# EAGLE board MMU8Ltqfp (EAGLE 6.6.0)
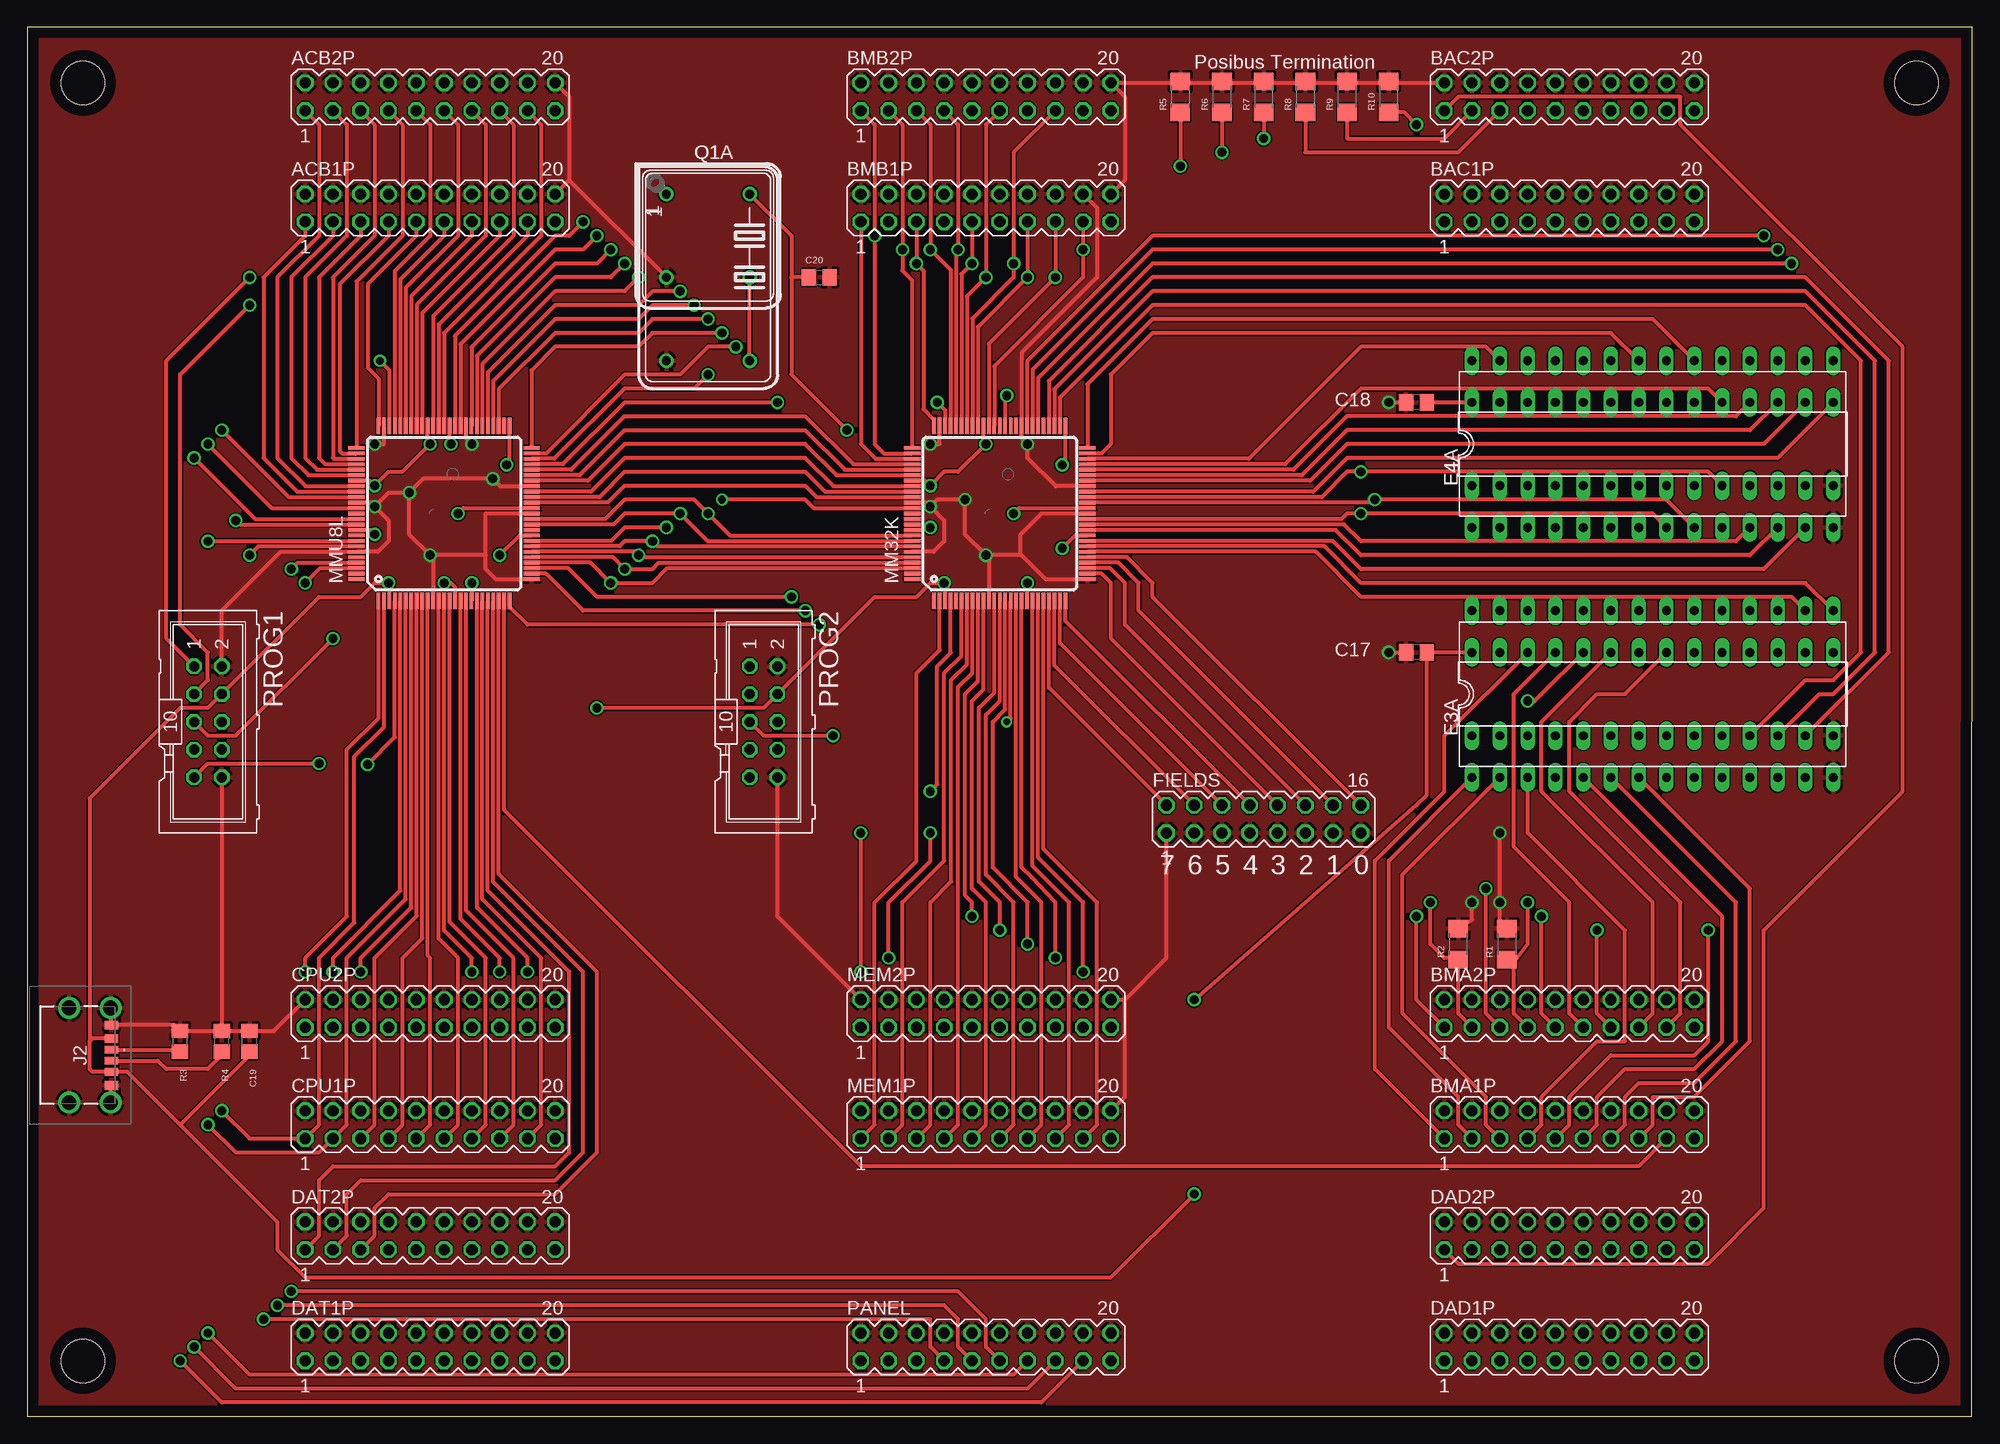
[diagram p2: board, top side]
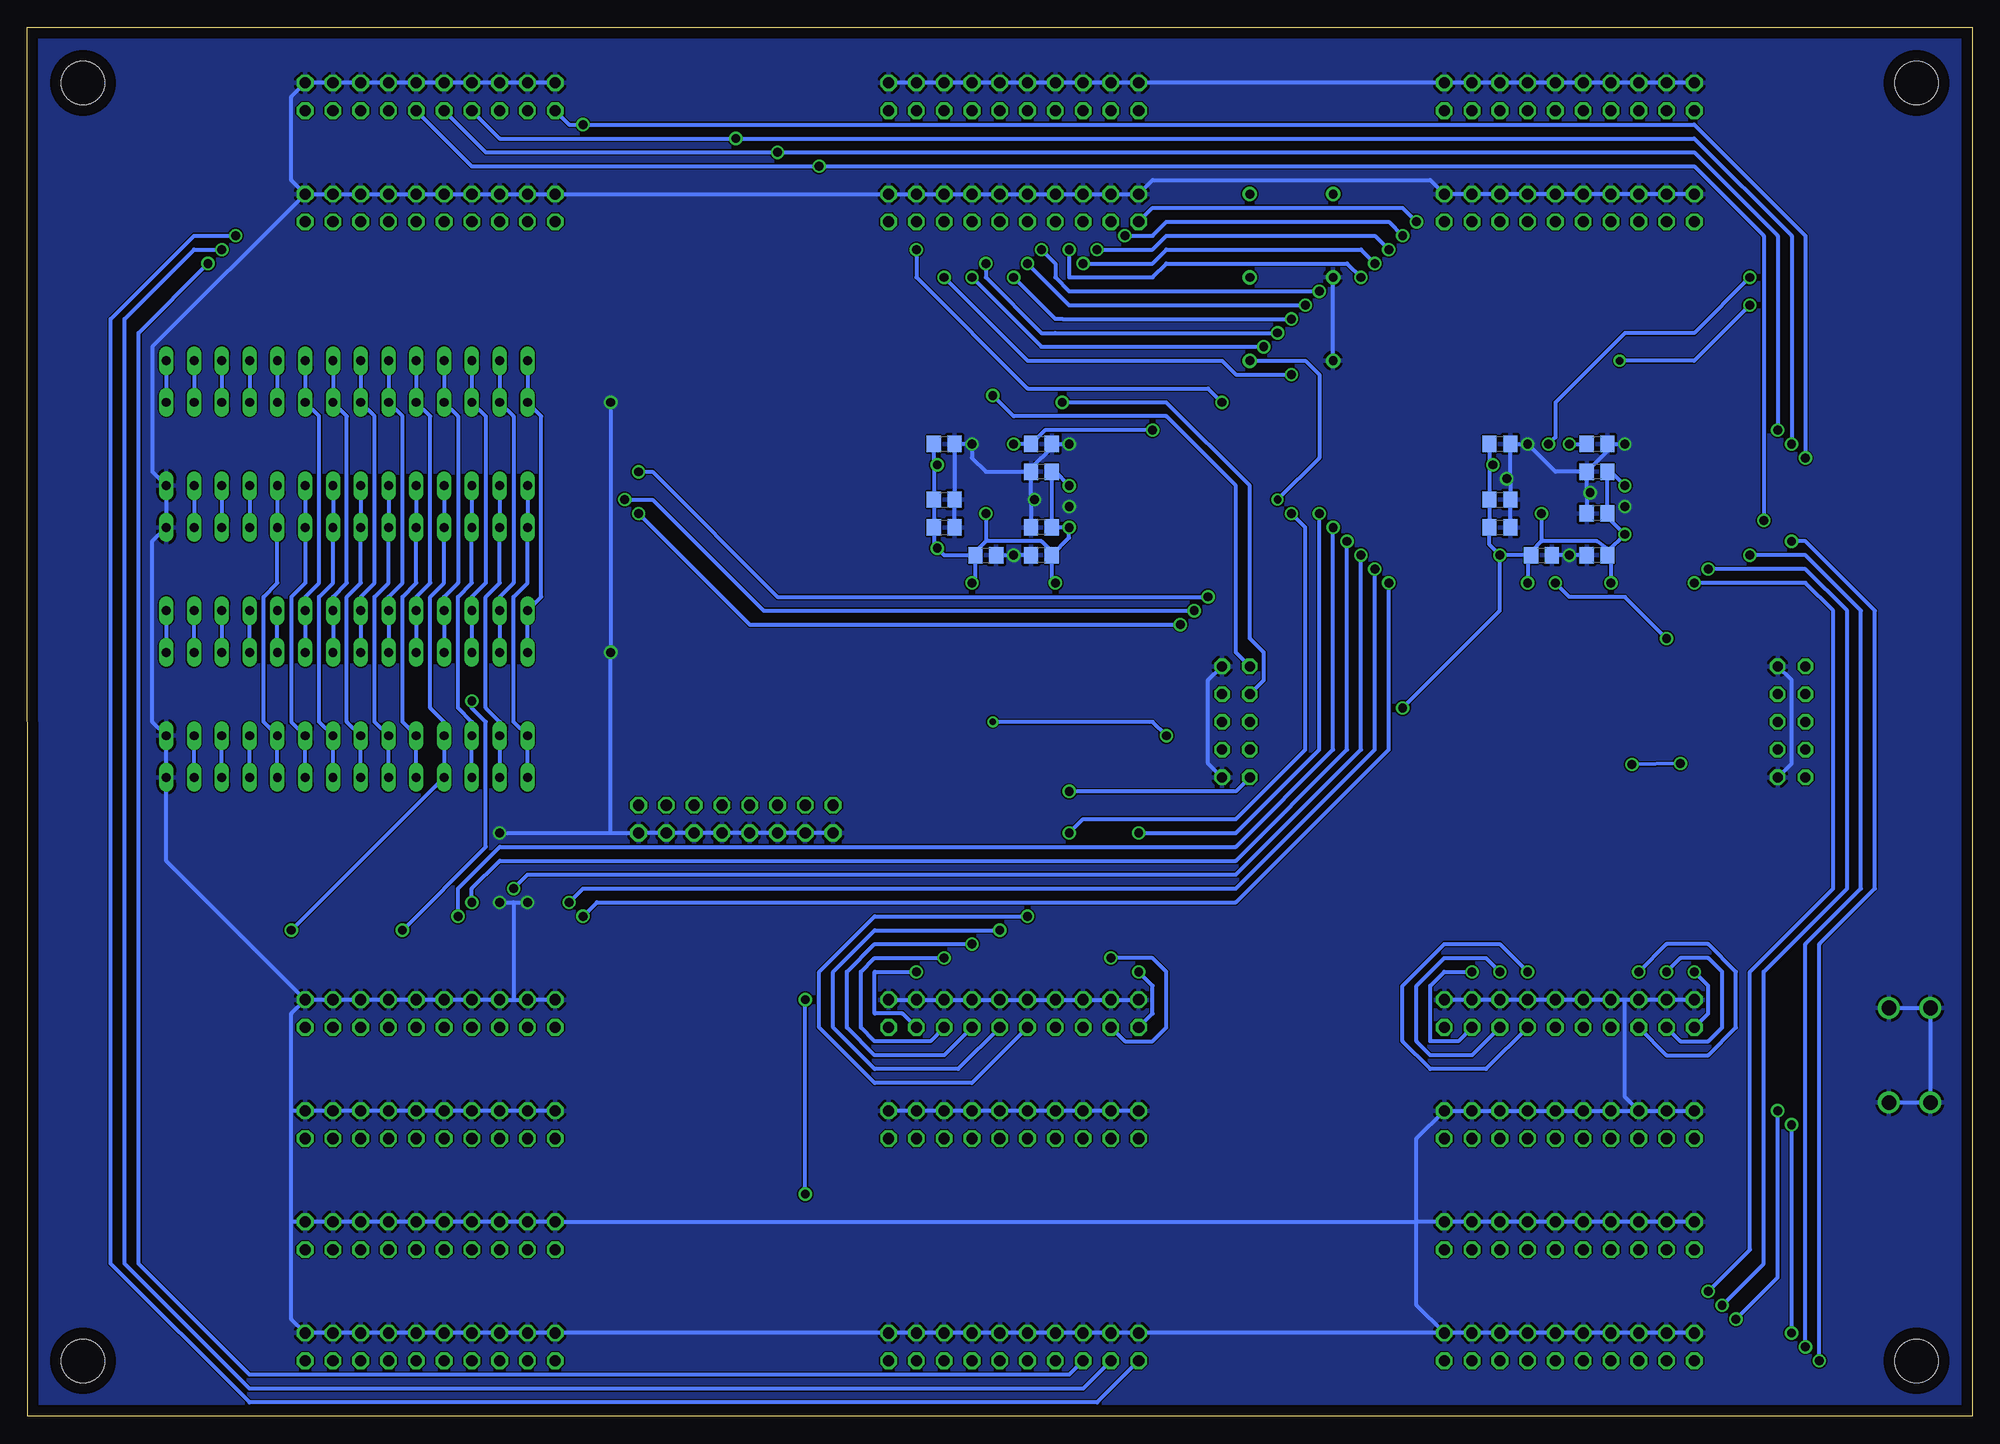
[diagram p3: board, bottom side, seen from below]

Size 177.8 x 127 mm. Coordinates in mm from the lower left corner, seen from the top.
Outline: 0,0 177.78,0 177.8,127 0,127 0,0
Copper layers (1*16): Top 0.035mm / dielectric 1.5mm / Bottom 0.035mm
Design rules "default *": minimum track width 10mil, minimum drill 24mil, track to track 5mil, track to pad 5mil, pad to pad 5mil, via to via 8mil, smd to smd 5mil, copper to edge 40mil, drill to drill 8mil, minimum pad ring 10mil, minimum via ring 8mil, stop-mask expansion 4mil, vias tented up to drill 0mil, thermal gap 10mil
Net classes: 0 default: width 0.356 mm; 1 supply: width 0.356 mm
Holes 3.97 mm at 5.08,121.92 172.72,121.92 172.72,5.08 5.08,5.08

## Footprints (pad centres in the part's own frame; a part is rotated, then mirrored left to right if it is on the bottom)
MA10-2 = drill 1.016 octagon: 1 -11.43,-1.27; 2 -11.43,1.27; 3 -8.89,-1.27; 4 -8.89,1.27; 5 -6.35,-1.27; 6 -6.35,1.27; 7 -3.81,-1.27; 8 -3.81,1.27; 9 -1.27,-1.27; 10 -1.27,1.27; 11 1.27,-1.27; 12 1.27,1.27; 13 3.81,-1.27; 14 3.81,1.27; 15 6.35,-1.27; 16 6.35,1.27; 17 8.89,-1.27; 18 8.89,1.27; 19 11.43,-1.27; 20 11.43,1.27
C0805 = smd 1.3 x 1.5: 1 -0.95,0; 2 0.95,0
DIL28-6 = drill 0.813 long: 1 -16.51,-7.62; 2 -13.97,-7.62; 3 -11.43,-7.62; 4 -8.89,-7.62; 5 -6.35,-7.62; 6 -3.81,-7.62; 7 -1.27,-7.62; 8 1.27,-7.62; 9 3.81,-7.62; 10 6.35,-7.62; 11 8.89,-7.62; 12 11.43,-7.62; 13 13.97,-7.62; 14 16.51,-7.62; 15 16.51,7.62; 16 13.97,7.62; 17 11.43,7.62; 18 8.89,7.62; 19 6.35,7.62; 20 3.81,7.62; 21 1.27,7.62; 22 -1.27,7.62; 23 -3.81,7.62; 24 -6.35,7.62; 25 -8.89,7.62; 26 -11.43,7.62; 27 -13.97,7.62; 28 -16.51,7.62
DIL28-3 = drill 0.813 long: 1 -16.51,-3.81; 2 -13.97,-3.81; 3 -11.43,-3.81; 4 -8.89,-3.81; 5 -6.35,-3.81; 6 -3.81,-3.81; 7 -1.27,-3.81; 8 1.27,-3.81; 9 3.81,-3.81; 10 6.35,-3.81; 11 8.89,-3.81; 12 11.43,-3.81; 13 13.97,-3.81; 14 16.51,-3.81; 15 16.51,3.81; 16 13.97,3.81; 17 11.43,3.81; 18 8.89,3.81; 19 6.35,3.81; 20 3.81,3.81; 21 1.27,3.81; 22 -1.27,3.81; 23 -3.81,3.81; 24 -6.35,3.81; 25 -8.89,3.81; 26 -11.43,3.81; 27 -13.97,3.81; 28 -16.51,3.81
MA08-2 = drill 1.016 octagon: 1 -8.89,-1.27; 2 -8.89,1.27; 3 -6.35,-1.27; 4 -6.35,1.27; 5 -3.81,-1.27; 6 -3.81,1.27; 7 -1.27,-1.27; 8 -1.27,1.27; 9 1.27,-1.27; 10 1.27,1.27; 11 3.81,-1.27; 12 3.81,1.27; 13 6.35,-1.27; 14 6.35,1.27; 15 8.89,-1.27; 16 8.89,1.27
USB497000A = smd 0.7 x 1.2: A5 -0.5,3.88; B5 0.5,3.88 | smd 0.76 x 1.2: A9 1.52,3.88; B9 -1.52,3.88 | smd 0.8 x 1.2: A12 2.75,3.88; B12 -2.75,3.88 | drill 1.34 pad 1.7: S1 -4.32,3.8; S2 4.32,3.8 | drill 1.34 pad 2.01: S3 -4.32,0; S4 4.32,0
TQFP-100 = smd 1.5 x 0.35: 1 -8,6; 2 -8,5.5; 3 -8,5; 4 -8,4.5; 5 -8,4; 6 -8,3.5; 7 -8,3; 8 -8,2.5; 9 -8,2; 10 -8,1.5; 11 -8,1; 12 -8,0.5; 13 -8,0; 14 -8,-0.5; 15 -8,-1; 16 -8,-1.5; 17 -8,-2; 18 -8,-2.5; 19 -8,-3; 20 -8,-3.5; 21 -8,-4; 22 -8,-4.5; 23 -8,-5; 24 -8,-5.5; 25 -8,-6; 51 8,-6; 52 8,-5.5; 53 8,-5; 54 8,-4.5; 55 8,-4; 56 8,-3.5; 57 8,-3; 58 8,-2.5; 59 8,-2; 60 8,-1.5; 61 8,-1; 62 8,-0.5; 63 8,0; 64 8,0.5; 65 8,1; 66 8,1.5; 67 8,2; 68 8,2.5; 69 8,3; 70 8,3.5; 71 8,4; 72 8,4.5; 73 8,5; 74 8,5.5; 75 8,6 | smd 0.35 x 1.5: 26 -6,-8; 27 -5.5,-8; 28 -5,-8; 29 -4.5,-8; 30 -4,-8; 31 -3.5,-8; 32 -3,-8; 33 -2.5,-8; 34 -2,-8; 35 -1.5,-8; 36 -1,-8; 37 -0.5,-8; 38 0,-8; 39 0.5,-8; 40 1,-8; 41 1.5,-8; 42 2,-8; 43 2.5,-8; 44 3,-8; 45 3.5,-8; 46 4,-8; 47 4.5,-8; 48 5,-8; 49 5.5,-8; 50 6,-8; 76 6,8; 77 5.5,8; 78 5,8; 79 4.5,8; 80 4,8; 81 3.5,8; 82 3,8; 83 2.5,8; 84 2,8; 85 1.5,8; 86 1,8; 87 0.5,8; 88 0,8; 89 -0.5,8; 90 -1,8; 91 -1.5,8; 92 -2,8; 93 -2.5,8; 94 -3,8; 95 -3.5,8; 96 -4,8; 97 -4.5,8; 98 -5,8; 99 -5.5,8; 100 -6,8
ML10 = drill 0.914 octagon: 1 -5.08,-1.27; 2 -5.08,1.27; 3 -2.54,-1.27; 4 -2.54,1.27; 5 0,-1.27; 6 0,1.27; 7 2.54,-1.27; 8 2.54,1.27; 9 5.08,-1.27; 10 5.08,1.27
DIL14S = drill 0.813: 1 -7.62,-3.81; 7 7.62,-3.81; 8 7.62,3.81; 14 -7.62,3.81
DIL08S = drill 0.813: 1 -3.81,-3.81; 4 3.81,-3.81; 5 3.81,3.81; 8 -3.81,3.81
R1206 = smd 1.6 x 1.803: 1 -1.422,0; 2 1.422,0
R0805 = smd 1.3 x 1.5: 1 -0.95,0; 2 0.95,0

## Placement (x,y rotation side)
ACB1P  10x2  [MA10-2]  36.83,110.49 0 top
ACB2P  10x2  [MA10-2]  36.83,120.65 0 top
BAC1P  10x2  [MA10-2]  140.97,110.49 0 top
BAC2P  10x2  [MA10-2]  140.97,120.65 0 top
BMA1P  10x2  [MA10-2]  140.97,26.67 0 top
BMA2P  10x2  [MA10-2]  140.97,36.83 0 top
BMB1P  10x2  [MA10-2]  87.63,110.49 0 top
BMB2P  10x2  [MA10-2]  87.63,120.65 0 top
C1  0.1uF  [C0805]  34.29,82.55 180 bottom
C2  0.1uF  [C0805]  43.18,83.82 0 bottom
C3  0.1uF  [C0805]  34.29,78.74 180 bottom
C4  0.1uF  [C0805]  39.37,78.74 0 bottom
C5  0.1uF  [C0805]  43.18,81.28 0 bottom
C6  0.1uF  [C0805]  43.18,88.9 0 bottom
C7  0.1uF  [C0805]  34.29,88.9 0 bottom
C8  0.1uF  [C0805]  34.29,86.36 180 bottom
C9  0.1uF  [C0805]  85.09,81.28 180 bottom
C10  0.1uF  [C0805]  93.98,83.82 0 bottom
C11  0.1uF  [C0805]  85.09,78.74 180 bottom
C12  0.1uF  [C0805]  90.17,78.74 0 bottom
C13  0.1uF  [C0805]  93.98,81.28 0 bottom
C14  0.1uF  [C0805]  93.98,88.9 0 bottom
C15  0.1uF  [C0805]  85.09,88.9 0 bottom
C16  0.1uF  [C0805]  85.09,86.36 180 bottom
C17  0.1uF  [C0805]  127,69.85 180 top
C18  0.1uF  [C0805]  127,92.71 180 top
C19  10uF  [C0805]  20.32,34.29 90 top
C20  10uF  [C0805]  72.39,104.14 0 top
CPU1P  10x2  [MA10-2]  36.83,26.67 0 top
CPU2P  10x2  [MA10-2]  36.83,36.83 0 top
DAD1P  10x2  [MA10-2]  140.97,6.35 0 top
DAD2P  10x2  [MA10-2]  140.97,16.51 0 top
DAT1P  10x2  [MA10-2]  36.83,6.35 0 top
DAT2P  10x2  [MA10-2]  36.83,16.51 0 top
E3  DS1230  [DIL28-6]  148.59,66.04 0 top
E3A  DS1230  [DIL28-3]  148.59,66.04 0 top
E4  DS1230  [DIL28-6]  148.59,88.9 0 top
E4A  DS1230  [DIL28-3]  148.59,88.9 0 top
FIELDS  [MA08-2]  113.03,54.61 0 top
J2  USB-C  [USB497000A]  3.81,33.02 270 top
MEM1P  10x2  [MA10-2]  87.63,26.67 0 top
MEM2P  10x2  [MA10-2]  87.63,36.83 0 top
MM32K  ATF1508-100  [TQFP-100]  88.9,82.55 90 top
MMU8L  ATF1508-100  [TQFP-100]  38.1,82.55 90 top
PANEL  10x2  [MA10-2]  87.63,6.35 0 top
PROG1  [ML10]  16.51,63.5 270 top
PROG2  [ML10]  67.31,63.5 270 top
Q1  20MHz  [DIL14S]  62.23,104.14 270 top
Q1A  20MHz  [DIL08S]  62.23,107.95 270 top
R1  100  [R1206]  135.25,43.18 90 top
R2  100  [R1206]  130.81,43.18 90 top
R3  5.1K  [R0805]  13.97,34.29 90 top
R4  5.1K  [R0805]  17.78,34.29 90 top
R5  100  [R1206]  105.41,120.65 90 top
R6  100  [R1206]  109.22,120.65 90 top
R7  100  [R1206]  113.03,120.65 90 top
R8  100  [R1206]  116.84,120.65 90 top
R9  100  [R1206]  120.65,120.65 90 top
R10  100  [R1206]  124.46,120.65 90 top

## Tracks (layer width: path | path; a pad name or v marks a point on that pad's centre or on a via)
!ACLR
  Top 0.356: ACB2P.7 34.29,118.11 34.29,107.95 30.1,103.76 MMU8L.76
!BF_ENABLE
  Top 0.356: CPU1P.13 41.91,26.67 41.91,41.91 38.6,45.22 MMU8L.14
!CS
  Top 0.356: E4.20 148.59,100.33 102.87,100.33 96.9,94.36 MM32K.50
  Bottom 0.356: E4.20 E4A.20 151.13,91.44 151.13,76.2 152.4,74.93 E3.20 E3A.20
!DF_ENABLE
  Top 0.356: CPU1P.17 46.99,26.67 46.99,41.91 41.6,47.3 MMU8L.20
!EA
  Top 0.356: BMA1P.17 147.32,22.86 76.2,22.86 43.6,55.46 MMU8L.24
!EA0  (via drill 0.81)
  Top 0.356: v161.29,105.41 102.87,105.41 92.4,94.94 MM32K.56
  Bottom 0.356: PANEL.5 82.55,3.81 157.48,3.81 167.64,13.97 167.64,99.06 v161.29,105.41
!EA1  (via drill 0.81)
  Top 0.356: v160.02,106.68 102.87,106.68 91.9,95.71 MM32K.57
  Bottom 0.356: PANEL.3 81.28,2.54 157.48,2.54 168.91,13.97 168.91,100.33 162.56,106.68 v160.02,106.68
!EA2  (via drill 0.81)
  Top 0.356: v158.75,107.95 102.87,107.95 91.4,96.48 MM32K.58
  Bottom 0.356: PANEL.1 80.01,1.27 157.48,1.27 170.18,13.97 170.18,100.33 162.56,107.95 v158.75,107.95
!EMA  (via drill 0.81)
  Top 0.356: v76.2,40.64 v76.2,53.34 | MMU8L.36 53.61,81.55 54.61,82.55 v59.69,82.55 62.19,80.05 MM32K.93
  Bottom 0.356: MEM2P.1 74.93,36.83 74.93,39.37 v76.2,40.64 | v76.2,53.34 67.31,53.34 59.69,60.96 v59.69,82.55
!EXDA0
  Top 0.356: DAT2P.1 26.67,16.51 26.67,21.59 27.94,22.86 48.26,22.86 49.53,24.13 49.53,40.64 42.1,48.07 MMU8L.21
!EXDA1
  Top 0.356: DAT2P.3 29.21,16.51 29.21,20.32 30.48,21.59 48.26,21.59 50.8,24.13 50.8,40.64 42.6,48.84 MMU8L.22
!EXDA2
  Top 0.356: DAT2P.5 31.75,16.51 31.75,19.05 33.02,20.32 48.26,20.32 52.07,24.13 52.07,40.64 43.1,49.61 MMU8L.23
!FS0
  Top 0.356: MM32K.30 100.52,78.55 102.87,76.2 102.87,74.93 FIELDS.16
!FS1
  Top 0.356: MM32K.29 99.75,78.05 101.6,76.2 101.6,73.66 FIELDS.14
!FS2
  Top 0.356: FIELDS.12 100.33,72.39 100.33,76.2 98.98,77.55 MM32K.28
!FS3
  Top 0.356: FIELDS.10 99.06,71.12 99.06,76.2 98.21,77.05 MM32K.27
!FS4
  Top 0.356: FIELDS.8 94.9,72.74 MM32K.25
!FS5
  Top 0.356: FIELDS.6 94.4,70.7 MM32K.24
!FS6
  Top 0.356: FIELDS.4 93.9,68.66 MM32K.23
!FS7
  Top 0.356: FIELDS.2 93.4,66.62 MM32K.22
!IB00
  Top 0.356: ACB1P.17 45.72,107.95 37.6,99.83 MMU8L.64
!IB01
  Top 0.356: ACB1P.15 43.18,107.95 36.1,100.87 MMU8L.67
!IB02
  Top 0.356: ACB1P.13 40.64,107.95 35.1,102.41 MMU8L.69
!IB03
  Top 0.356: ACB1P.11 38.1,107.95 34.1,103.95 MMU8L.71
!IB04
  Top 0.356: ACB1P.9 35.56,107.95 31.11,103.5 31.11,95.89 32.1,94.9 MMU8L.75
!IB05
  Top 0.356: ACB1P.7 33.02,107.95 28.57,103.5 28.57,88.27 28.79,88.05 MMU8L.77
!IB06
  Top 0.356: ACB1P.5 30.48,107.95 26.67,104.14 26.67,87.63 27.25,87.05 MMU8L.79
!IB07
  Top 0.356: ACB1P.3 27.94,107.95 24.13,104.14 24.13,87.63 25.71,86.05 MMU8L.81
!IB08
  Top 0.356: ACB1P.1 25.4,107.95 21.59,104.14 21.59,87.63 24.67,84.55 MMU8L.84
!IB09
  Top 0.356: ACB2P.17 46.99,118.11 46.99,107.95 38.1,99.06 MMU8L.63
!IB10
  Top 0.356: ACB2P.15 44.45,118.11 44.45,107.95 37.1,100.6 MMU8L.65
!IB11
  Top 0.356: ACB2P.13 41.91,118.11 41.91,107.95 35.6,101.64 MMU8L.68
!INT_INH
  Top 0.356: CPU1P.7 34.29,26.67 34.29,41.91 36.1,43.72 MMU8L.9
!IRQ
  Top 0.356: ACB2P.9 36.83,118.11 36.83,107.95 33.6,104.72 MMU8L.72
!KEY_CLR
  Top 0.356: CPU1P.9 36.83,26.67 36.83,41.91 36.6,42.14 MMU8L.10
!KEY_DF0  (via drill 0.81)
  Top 0.356: PANEL.11 87.63,6.35 87.63,8.89 85.09,11.43 v24.13,11.43 | v25.4,76.2 26.75,77.55 MMU8L.98
  Bottom 0.356: v24.13,11.43 20.32,15.24 20.32,40.64 12.7,48.26 12.7,73.66 15.24,76.2 v25.4,76.2
!KEY_DF1  (via drill 0.81)
  Top 0.356: PANEL.9 85.09,6.35 85.09,8.89 83.82,10.16 v22.86,10.16 | v24.13,77.47 24.71,78.05 MMU8L.97
  Bottom 0.356: v22.86,10.16 19.05,13.97 19.05,40.64 11.43,48.26 11.43,73.66 15.24,77.47 v24.13,77.47
!KEY_DF2  (via drill 0.81)
  Top 0.356: PANEL.7 82.55,6.35 82.55,8.89 v21.59,8.89 | v17.78,27.94 20.32,25.4 CPU1P.1 26.67,26.67 26.67,41.91 29.9,45.14 29.9,60.34 32.6,63.04 MMU8L.2
  Bottom 0.356: v21.59,8.89 17.78,12.7 v17.78,27.94
!KEY_IF0  (via drill 0.81)
  Top 0.356: PANEL.17 92.71,1.27 17.78,1.27 v13.97,5.08 | v16.51,80.01 16.55,80.05 MMU8L.93
  Bottom 0.356: v13.97,5.08 13.97,43.18 8.89,48.26 8.89,73.66 15.24,80.01 v16.51,80.01
!KEY_IF1  (via drill 0.81)
  Top 0.356: PANEL.15 91.44,2.54 19.05,2.54 v15.24,6.35 | v20.32,78.74 21.13,79.55 MMU8L.94
  Bottom 0.356: v15.24,6.35 15.24,43.18 10.16,48.26 10.16,73.66 15.24,78.74 v20.32,78.74
!KEY_IF2  (via drill 0.81)
  Top 0.356: PANEL.13 90.17,3.81 20.32,3.81 v16.51,7.62 | v16.51,26.67 19.05,24.13 26.67,24.13 CPU1P.3 29.21,26.67 29.21,41.91 34.6,47.3 MMU8L.6
  Bottom 0.356: v16.51,7.62 v16.51,26.67
!KEY_LOAD  (via drill 0.81)
  Top 0.356: v40.64,40.64 40.64,41.91 38.1,44.45 MMU8L.13
  Bottom 0.356: CPU2P.13 44.45,31.75 49.53,31.75 52.07,34.29 52.07,39.37 48.26,43.18 43.18,43.18 v40.64,40.64
!LINE
  Top 0.356: ACB2P.1 26.67,118.11 26.67,107.95 22.86,104.14 22.86,87.63 25.44,85.05 MMU8L.83
!LOAD_SF
  Top 0.356: CPU1P.5 31.75,26.67 31.75,41.91 35.6,45.76 MMU8L.8
!MEMDONE  (via drill 0.81)
  Top 0.356: BMA2P.1 127,38.1 v127,45.72 | MMU8L.29 51.49,78.05 v53.34,76.2 57.15,76.2 58.5,77.55 MM32K.98
  Bottom 0.356: v127,45.72 125.73,46.99 67.31,46.99 53.34,60.96 v53.34,76.2
!OE
  Top 0.356: E4.22 144.78,99.06 102.87,99.06 99.06,95.25 99.06,88.9 98.21,88.05 MM32K.49
  Bottom 0.356: E4.22 E4A.22 146.05,91.44 146.05,76.2 147.32,74.93 E3.22 E3A.22
!RUN
  Top 0.356: ACB2P.5 31.75,118.11 31.75,107.95 27.94,104.14 27.94,87.63 28.02,87.55 MMU8L.78
!SKIP
  Top 0.356: ACB2P.11 39.37,118.11 39.37,107.95 34.6,103.18 MMU8L.70
!SP_CYC_NEXT
  Top 0.356: CPU1P.15 44.45,26.67 44.45,41.91 40.1,46.26 MMU8L.17
!STROBE  (via drill 0.81)
  Top 0.356: BMA2P.5 133.35,36.83 v133.35,48.26 | MMU8L.31 55.57,79.05 v55.88,78.74 56.07,78.55 MM32K.96
  Bottom 0.356: v133.35,48.26 132.08,49.53 67.31,49.53 55.88,60.96 v55.88,78.74
!TTINST
  Top 0.356: ACB2P.3 29.21,118.11 29.21,107.95 25.4,104.14 25.4,87.63 26.48,86.55 MMU8L.80
!WE
  Top 0.356: E4.27 133.35,97.79 121.92,97.79 111.68,87.55 MM32K.48
  Bottom 0.356: E4.27 E4A.27 133.35,91.44 133.35,76.2 134.62,74.93 E3.27 E3A.27
AC_LOW  (via drill 0.81)
  Top 0.356: v25.4,40.64 25.4,41.91 29.21,45.72 29.21,60.96 32.1,63.85 MMU8L.1
  Bottom 0.356: CPU2P.1 24.13,36.83 24.13,39.37 v25.4,40.64
BMA00
  Top 0.356: BMA1P.15 148.59,26.67 148.59,29.21 152.4,29.21 157.48,34.29 157.48,48.26 E3.7
  Bottom 0.356: E4A.7 E4.7 147.32,76.2 148.59,74.93 148.59,63.5 E3A.7 E3.7
BMA01
  Top 0.356: BMA1P.13 146.05,26.67 146.05,29.21 147.32,30.48 152.4,30.48 156.21,34.29 156.21,46.99 E3.6
  Bottom 0.356: E4A.6 E4.6 144.78,76.2 146.05,74.93 146.05,63.5 E3A.6 E3.6
BMA02
  Top 0.356: BMA1P.11 143.51,26.67 143.51,29.21 146.05,31.75 152.4,31.75 154.94,34.29 154.94,45.72 E3.5
  Bottom 0.356: E4A.5 E4.5 142.24,76.2 143.51,74.93 143.51,63.5 E3A.5 E3.5
BMA03  (via drill 0.81)
  Top 0.356: BMA1P.9 140.97,26.67 140.97,29.21 144.78,33.02 152.4,33.02 153.67,34.29 v153.67,44.45
  Bottom 0.356: E4A.4 E4.4 139.7,76.2 140.97,74.93 140.97,64.77 139.7,63.5 E3A.4 E3.4 v153.67,44.45
BMA04
  Top 0.356: BMA1P.7 138.43,26.67 138.43,29.21 143.51,34.29 146.05,34.29 146.05,44.45 137.16,53.34 E3.3
  Bottom 0.356: E4A.3 E4.3 137.16,76.2 138.43,74.93 138.43,64.77 137.16,63.5 E3A.3 E3.3
BMA05
  Top 0.356: BMA1P.5 133.35,26.67 133.35,29.21 125.73,36.83 125.73,49.53 E3.2
  Bottom 0.356: E3.2 E3A.2 134.62,63.5 135.89,64.77 135.89,74.93 134.62,76.2 E4.2 E4A.2
BMA06
  Top 0.356: BMA1P.3 130.81,26.67 130.81,29.21 124.46,35.56 124.46,50.8 E3.1
  Bottom 0.356: E3.1 E3A.1 133.35,63.5 133.35,74.93 132.08,76.2 E4.1 E4A.1
BMA07
  Top 0.356: BMA1P.1 123.19,31.75 123.19,50.8 129.54,57.15 129.54,62.23 E3A.26
  Bottom 0.356: E3A.26 E3.26 137.16,74.93 135.89,76.2 135.89,91.44 E4A.26 E4.26
BMA08
  Top 0.356: BMA2P.17 151.13,36.83 151.13,46.99 140.97,57.15 140.97,63.5 143.51,66.04 146.05,66.04 E3A.21
  Bottom 0.356: E3A.21 E3.21 149.86,74.93 148.59,76.2 148.59,91.44 E4A.21 E4.21
BMA09
  Top 0.356: BMA2P.15 148.59,36.83 148.59,46.99 138.43,57.15 138.43,63.5 E3A.23
  Bottom 0.356: E4.23 E4A.23 143.51,91.44 143.51,76.2 144.78,74.93 E3.23 E3A.23
BMA10  (via drill 0.81)
  Top 0.356: BMA2P.13 143.51,36.83 v143.51,44.45 | v137.16,65.41 137.79,65.41 138.43,66.04 E3A.24
  Bottom 0.356: E4.24 E4A.24 140.97,91.44 140.97,76.2 142.24,74.93 E3.24 E3A.24 | v143.51,44.45 135.89,52.07 135.89,63.5 137.16,64.77 v137.16,65.41
BMA11
  Top 0.356: BMA2P.11 140.97,36.83 140.97,46.99 135.89,52.07 135.89,66.04 E3A.25
  Bottom 0.356: E4.25 E4A.25 138.43,91.44 138.43,76.2 139.7,74.93 E3.25 E3A.25
CLK  (via drill 0.7)
  Top 0.356: Q1.8 Q1A.5 | v63.5,83.82 71.12,83.82 71.89,83.05 MM32K.87
  Bottom 0.356: Q1.8 60.96,96.52 59.69,95.25 59.69,87.63 v63.5,83.82
D0
  Top 0.356: E4.11 156.21,80.01 121.92,80.01 120.38,81.55 MM32K.36
  Bottom 0.356: E4A.11 E4.11
D1
  Top 0.356: E4.12 157.48,78.74 121.92,78.74 119.61,81.05 MM32K.35
  Bottom 0.356: E4A.12 E4.12
D2
  Top 0.356: E4.13 158.75,77.47 121.92,77.47 119.34,80.05 MM32K.33
  Bottom 0.356: E4A.13 E4.13
D3
  Top 0.356: E4A.15 160.02,87.63 120.65,87.63 117.57,84.55 MM32K.42
  Bottom 0.356: E4.15 E4A.15
D4
  Top 0.356: E4A.16 158.75,88.9 120.65,88.9 117.3,85.55 MM32K.44
  Bottom 0.356: E4.16 E4A.16
D5
  Top 0.356: E4A.17 157.48,90.17 120.65,90.17 116.53,86.05 MM32K.45
  Bottom 0.356: E4.17 E4A.17
D6
  Top 0.356: E4A.18 156.21,91.44 120.65,91.44 115.76,86.55 MM32K.46
  Bottom 0.356: E4.18 E4A.18
D7
  Top 0.356: E4A.19 153.67,93.98 121.92,93.98 114.99,87.05 MM32K.47
  Bottom 0.356: E4.19 E4A.19
D8
  Top 0.356: E3A.11 162.56,67.31 165.1,67.31 167.64,69.85 167.64,96.52 162.56,101.6 102.87,101.6 94.4,93.13 MM32K.52
  Bottom 0.356: E3.11 E3A.11
D9
  Top 0.356: E3A.12 163.83,66.04 165.1,66.04 168.91,69.85 168.91,96.52 162.56,102.87 102.87,102.87 93.9,93.9 MM32K.53
  Bottom 0.356: E3.12 E3A.12
D10
  Top 0.356: E3A.13 170.18,69.85 170.18,96.52 162.56,104.14 102.87,104.14 93.4,94.67 MM32K.54
  Bottom 0.356: E3.13 E3A.13
D11
  Top 0.356: E3.15 162.56,76.2 121.92,76.2 118.57,79.55 MM32K.32
  Bottom 0.356: E3.15 E3A.15
DEL1
  Top 0.356: MMU8L.40 53.07,83.55 54.61,85.09 71.12,85.09 72.16,84.05 MM32K.85
DEL2
  Top 0.356: MMU8L.41 52.3,84.05 54.61,86.36 71.12,86.36 72.93,84.55 MM32K.84
DEL3
  Top 0.356: MMU8L.42 51.53,84.55 54.61,87.63 71.12,87.63 73.7,85.05 MM32K.83
DEL4
  Top 0.356: MMU8L.44 51.26,85.55 54.61,88.9 71.12,88.9 73.97,86.05 MM32K.81
DEL5
  Top 0.356: MMU8L.45 50.49,86.05 54.61,90.17 71.12,90.17 74.74,86.55 MM32K.80
DEL6
  Top 0.356: MMU8L.46 49.72,86.55 54.61,91.44 71.12,91.44 75.51,87.05 MM32K.79
E_OR_F_SET  (via drill 0.81)
  Top 0.356: v45.72,40.64 45.72,41.91 41.1,46.53 MMU8L.19
  Bottom 0.356: CPU2P.17 46.99,34.29 49.53,34.29 49.53,39.37 48.26,40.64 v45.72,40.64
EA0  (via drill 0.81)
  Top 0.356: E4A.10 153.67,86.36 v121.92,86.36 120.65,86.36 118.34,84.05 MM32K.41 | v69.85,74.93 52.07,74.93 49.45,77.55 MMU8L.28
  Bottom 0.356: E4A.10 E4.10 154.94,76.2 156.21,74.93 156.21,63.5 E3A.10 E3.10 | v121.92,86.36 120.65,86.36 109.22,74.93 v69.85,74.93
EA1  (via drill 0.81)
  Top 0.356: E4.9 149.86,83.82 v123.19,83.82 122.92,83.55 MM32K.40 | v71.12,73.66 50.8,73.66 47.41,77.05 MMU8L.27
  Bottom 0.356: E4A.9 E4.9 152.4,76.2 153.67,74.93 153.67,63.5 E3A.9 E3.9 | v123.19,83.82 120.65,83.82 110.49,73.66 v71.12,73.66
EA2  (via drill 0.81)
  Top 0.356: E4.8 148.59,82.55 v121.92,82.55 120.65,82.55 120.15,82.05 MM32K.37 | v72.39,72.39 45.72,72.39 44.1,74.01 MMU8L.25
  Bottom 0.356: E4A.8 E4.8 149.86,76.2 151.13,74.93 151.13,63.5 E3A.8 E3.8 | v121.92,82.55 111.76,72.39 v72.39,72.39
EMA  (via drill 0.81)
  Top 0.356: v78.74,41.91 78.74,46.99 82.55,50.8 v82.55,53.34 | MMU8L.37 52.84,82.05 54.61,83.82 60.96,83.82 v62.23,82.55 64.23,80.55 MM32K.92
  Bottom 0.356: MEM2P.3 77.47,34.29 74.93,34.29 73.66,35.56 73.66,40.64 74.93,41.91 v78.74,41.91 | v82.55,53.34 81.28,54.61 67.31,54.61 60.96,60.96 60.96,81.28 v62.23,82.55
FIELD1  (via drill 0.81)
  Top 0.356: BMA2P.9 138.43,36.83 v138.43,45.72 | v58.42,81.28 54.61,81.28 53.38,80.05 MMU8L.33
  Bottom 0.356: v138.43,45.72 138.43,48.26 134.62,52.07 67.31,52.07 58.42,60.96 v58.42,81.28
GND  (via drill 0.81)
  Top 0.356: ACB2P.20 49.53,120.65 49.53,113.03 | 49.53,113.03 ACB1P.20 | Q1A.4 49.53,113.03 | CPU2P.2 22.54,35.24 R4.2 | PROG1.2 17.78,73.66 23.17,79.05 MMU8L.95 32.06,79.05 33.02,80.01 33.02,81.92 v31.75,83.19 | 100.33,38.1 104.14,41.91 FIELDS.1 | J2.S1 7.69,37.26 J2.B12 13.44,35.77 R3.2 R4.2 | J2.S2 7.61,30.19 J2.A12 | PROG1.10 R4.2 | MEM2P.2 68.58,45.72 PROG2.10 | MEM1P.20 100.33,29.21 100.33,38.1 | 100.33,38.1 MEM2P.20 | R2.2 132.08,45.4 v132.08,46.99 | R1.2 134.62,45.4 v134.62,46.99 v134.62,53.34 | BMB1P.20 100.33,113.03 100.33,120.65 BMB2P.20 105.41,121.92 | BMB1P.18 97.79,110.49 97.79,104.14 90.9,97.25 MM32K.59 90.9,89.44 v91.44,88.9 91.44,87.63 94.02,85.05 MM32K.43 | C18.2 v124.46,92.71 | v124.46,69.85 C17.2 | 105.41,121.92 109.22,121.92 | 109.22,121.92 113.03,121.92 | 113.03,121.92 116.84,121.92 | 116.84,121.92 120.65,121.92 | 120.65,121.92 124.46,121.92 | 124.46,121.92 BAC2P.2 | R5.2 105.41,121.92 | R6.2 109.22,121.92 | R7.2 113.03,121.92 | R8.2 116.84,121.92 | R9.2 120.65,121.92 | R10.2 124.46,121.92 | v40.64,88.9 40.1,89.44 MMU8L.59 | v36.83,78.74 37.1,78.47 MMU8L.11 | MMU8L.43 43.22,85.05 v42.55,85.72 36.2,85.72 v34.92,84.45 | 41.91,78.74 41.91,82.55 MMU8L.38 | MMU8L.26 42.83,76.55 41.91,77.47 41.91,78.74 | 41.91,78.74 v36.83,78.74 | v31.75,83.19 31.39,83.55 MMU8L.86 | v31.75,83.19 33.02,84.45 v34.92,84.45 | v36.83,78.74 34.92,80.64 v34.92,84.45 | v31.75,88.9 32.6,88.9 MMU8L.74 | v82.55,83.19 82.19,83.55 MM32K.86 | v82.55,83.19 83.82,81.92 83.82,80.01 82.86,79.05 MM32K.95 | v87.63,78.74 87.9,78.47 MM32K.11 | v82.55,83.19 83.19,83.82 v85.72,83.82 85.72,80.64 v87.63,78.74 | 90.81,78.74 90.9,78.74 93.09,76.55 MM32K.26
  Top 0.356: 90.81,78.74 v87.63,78.74 | 90.81,78.74 90.81,80.64 92.71,82.55 MM32K.38 | v82.55,88.9 83.4,88.9 MM32K.74
  Bottom 0.356: ACB1P.2 ACB1P.4 ACB1P.6 ACB1P.8 ACB1P.10 ACB1P.12 ACB1P.14 ACB1P.16 ACB1P.18 ACB1P.20 49.53,113.03 74.93,113.03 BMB1P.2 BMB1P.4 BMB1P.6 BMB1P.8 BMB1P.10 BMB1P.12 BMB1P.14 BMB1P.16 BMB1P.18 BMB1P.20 BAC1P.2 BAC1P.4 BAC1P.6 BAC1P.8 BAC1P.10 BAC1P.12 BAC1P.14 BAC1P.16 BAC1P.18 BAC1P.20 | ACB2P.2 ACB2P.4 ACB2P.6 ACB2P.8 ACB2P.10 ACB2P.12 ACB2P.14 ACB2P.16 ACB2P.18 ACB2P.20 BMB2P.2 BMB2P.4 BMB2P.6 BMB2P.8 BMB2P.10 BMB2P.12 BMB2P.14 BMB2P.16 BMB2P.18 BMB2P.20 | Q1.7 Q1A.4 | CPU2P.2 CPU2P.4 CPU2P.6 31.75,38.1 | 31.75,38.1 CPU2P.8 CPU2P.10 CPU2P.12 CPU2P.14 CPU2P.16 CPU2P.18 CPU2P.20 | DAT2P.2 DAT2P.4 DAT2P.6 DAT2P.8 DAT2P.10 DAT2P.12 DAT2P.14 DAT2P.16 DAT2P.18 DAT2P.20 50.8,17.78 | CPU1P.6 CPU1P.8 CPU1P.10 CPU1P.12 CPU1P.14 CPU1P.16 CPU1P.18 CPU1P.20 50.8,25.4 50.8,17.78 | CPU1P.6 CPU1P.4 CPU1P.2 | DAT1P.2 DAT1P.4 DAT1P.6 DAT1P.8 DAT1P.10 DAT1P.12 DAT1P.14 DAT1P.16 DAT1P.18 DAT1P.20 | DAT1P.20 50.8,10.16 50.8,17.78 | CPU1P.6 31.75,29.21 31.75,38.1 | BAC2P.2 BAC2P.4 BAC2P.6 BAC2P.8 BAC2P.10 BAC2P.12 BAC2P.14 BAC2P.16 BAC2P.18 BAC2P.20 153.67,120.65 153.67,113.03 BAC1P.20 | BMA1P.2 BMA1P.4 BMA1P.6 BMA1P.8 BMA1P.10 BMA1P.12 BMA1P.14 BMA1P.16 BMA1P.18 BMA1P.20 153.67,27.94 | BMA2P.2 BMA2P.4 133.35,38.1 | BMA2P.20 BMA2P.18 BMA2P.16 BMA2P.14 BMA2P.12 BMA2P.10 BMA2P.8 BMA2P.6 133.35,38.1 | PROG1.10 16.51,59.69 16.51,67.31 PROG1.2 | PROG2.10 69.85,59.69 69.85,67.31 PROG2.2 | C3.2 v36.83,78.74 C4.2 | C5.2 C2.2 42.23,85.41 v42.55,85.72 42.23,86.04 C6.2 v40.64,88.9 38.1,86.36 C8.2 | C8.2 33.34,88.27 C7.2 v31.75,88.9 | MEM1P.2 MEM1P.4 MEM1P.6 MEM1P.8 MEM1P.10 MEM1P.12 MEM1P.14 MEM1P.16 MEM1P.18 MEM1P.20
  Bottom 0.356: MEM2P.20 MEM2P.18 MEM2P.16 MEM2P.14 MEM2P.12 MEM2P.10 MEM2P.8 MEM2P.6 MEM2P.4 MEM2P.2 | FIELDS.1 FIELDS.3 FIELDS.5 FIELDS.7 FIELDS.9 FIELDS.11 FIELDS.13 FIELDS.15 124.46,53.34 | J2.S2 J2.S4 J2.S3 J2.S1 | 153.67,17.78 153.67,8.89 DAD1P.20 DAD1P.18 DAD1P.16 DAD1P.14 DAD1P.12 DAD1P.10 DAD1P.8 DAD1P.6 DAD1P.4 DAD1P.2 PANEL.20 PANEL.18 PANEL.16 PANEL.14 PANEL.12 PANEL.10 PANEL.8 PANEL.6 PANEL.4 PANEL.2 DAT1P.20 | 153.67,17.78 153.67,27.94 | 153.67,27.94 153.67,36.83 BMA2P.20 | BMA2P.20 165.1,50.8 E3.14 E3A.14 166.37,63.5 166.37,80.01 E4.14 E4A.14 166.37,86.36 166.37,97.79 BAC1P.20 | 153.67,17.78 DAD2P.20 DAD2P.18 DAD2P.16 DAD2P.14 DAD2P.12 DAD2P.10 DAD2P.8 DAD2P.6 DAD2P.4 DAD2P.2 50.8,17.78 | v134.62,46.99 133.35,46.99 | 133.35,46.99 v132.08,46.99 | 133.35,46.99 133.35,38.1 | C13.2 C10.2 C14.2 v91.44,88.9 91.44,87.63 90.17,86.36 C16.2 | v124.46,92.71 v124.46,69.85 124.46,53.34 | v134.62,53.34 124.46,53.34 | C8.2 35.24,84.77 v34.92,84.45 35.24,84.14 C1.2 | v82.55,88.9 C15.2 84.14,88.58 86.04,86.68 C16.2 | C9.2 86.04,83.5 v85.72,83.82 86.04,84.14 C16.2 | C12.2 v87.63,78.74 C11.2
  pour Top: 0,0 177.8,0 177.8,127 0,127
  pour Bottom: 0,0 177.8,0 177.8,127 0,127
INIT  (via drill 0.81)
  Top 0.356: v15.24,87.63 20.82,82.05 MMU8L.89 | DAD2P.1 130.81,13.97 153.67,13.97 158.75,19.05 158.75,44.45 171.45,57.15 171.45,97.79 151.13,118.11 151.13,120.65 130.81,120.65 BAC2P.1 | v127,118.11 125.88,119.23 R10.1
  Bottom 0.356: BAC2P.1 128.27,118.11 v127,118.11 25.4,118.11 15.24,107.95 v15.24,87.63
IOP1  (via drill 0.81)
  Top 0.356: R5.1 v105.41,114.3 | v19.05,81.92 19.41,81.55 MMU8L.90
  Bottom 0.356: BAC2P.11 137.16,114.3 v105.41,114.3 25.4,114.3 19.05,107.95 v19.05,81.92
IOP2  (via drill 0.81)
  Top 0.356: R6.1 v109.22,115.57 | v17.78,90.17 23.9,84.05 MMU8L.85
  Bottom 0.356: BAC2P.9 135.89,115.57 v109.22,115.57 25.4,115.57 17.78,107.95 v17.78,90.17
IOP4  (via drill 0.81)
  Top 0.356: R7.1 v113.03,116.84 | v16.51,88.9 22.36,83.05 MMU8L.87
  Bottom 0.356: BAC2P.7 134.62,116.84 v113.03,116.84 25.4,116.84 16.51,107.95 v16.51,88.9
JMP_OR_JMS  (via drill 0.81)
  Top 0.356: v43.18,40.64 43.18,41.91 39.6,45.49 MMU8L.16
  Bottom 0.356: CPU2P.15 45.72,33.02 49.53,33.02 50.8,34.29 50.8,39.37 48.26,41.91 44.45,41.91 v43.18,40.64
MB00  (via drill 0.81)
  Top 0.356: BMB1P.17 v96.52,106.68 96.52,104.14 88.4,96.02 MM32K.64 | v68.58,92.71 54.61,92.71 48.95,87.05 MMU8L.47
  Bottom 0.356: v96.52,106.68 96.52,104.14 86.36,93.98 69.85,93.98 v68.58,92.71
MB01  (via drill 0.81)
  Top 0.356: BMB1P.15 v93.98,104.14 87.9,98.06 MM32K.65 | v62.23,95.25 60.96,93.98 54.61,93.98 48.18,87.55 MMU8L.48
  Bottom 0.356: v93.98,104.14 86.36,96.52 68.58,96.52 67.31,95.25 v62.23,95.25
MB02  (via drill 0.81)
  Top 0.356: BMB1P.13 v91.44,104.14 86.9,99.6 MM32K.67 | v64.77,97.79 62.23,97.79 59.69,95.25 54.61,95.25 47.41,88.05 MMU8L.49
  Bottom 0.356: v91.44,104.14 85.09,97.79 v64.77,97.79
MB03  (via drill 0.81)
  Top 0.356: BMB1P.9 v86.36,105.41 85.4,104.45 MM32K.70 | v60.96,101.6 57.15,101.6 55.88,100.33 48.26,100.33 42.6,94.67 MMU8L.54
  Bottom 0.356: v86.36,105.41 82.55,101.6 v60.96,101.6
MB04  (via drill 0.81)
  Top 0.356: BMB1P.5 v81.28,105.41 81.92,104.78 81.92,92.08 82.9,91.09 MM32K.75 | v54.61,105.41 53.34,104.14 48.26,104.14 41.1,96.98 MMU8L.57
  Bottom 0.356: v81.28,105.41 74.93,105.41 73.66,106.68 55.88,106.68 v54.61,105.41
MB05  (via drill 0.81)
  Top 0.356: v50.8,109.22 49.53,107.95 48.26,107.95 39.1,98.79 MMU8L.61 | BMB1P.1 76.2,88.9 77.55,87.55 MM32K.78
  Bottom 0.356: BMB1P.1 74.93,110.49 52.07,110.49 v50.8,109.22
MB06  (via drill 0.81)
  Top 0.356: BMB2P.15 90.17,115.57 v90.17,105.41 90.17,104.14 86.4,100.37 MM32K.68 | v63.5,99.06 57.15,99.06 55.88,97.79 48.26,97.79 46.1,95.63 MMU8L.50
  Bottom 0.356: v90.17,105.41 90.17,104.14 85.09,99.06 83.82,99.06 v63.5,99.06
MB07  (via drill 0.81)
  Top 0.356: BMB2P.11 87.63,118.11 v87.63,104.14 85.9,102.41 MM32K.69 | v62.23,100.33 57.15,100.33 55.88,99.06 48.26,99.06 43.1,93.9 MMU8L.53
  Bottom 0.356: v62.23,100.33 83.17,100.33 83.82,100.33 v87.63,104.14
MB08  (via drill 0.81)
  Top 0.356: BMB2P.7 85.09,118.11 v85.09,106.68 84.9,106.49 MM32K.71 | v59.69,102.87 57.15,102.87 55.88,101.6 48.26,101.6 42.1,95.44 MMU8L.55
  Bottom 0.356: v85.09,106.68 83.82,105.41 83.82,104.14 82.55,102.87 v59.69,102.87
MB09  (via drill 0.81)
  Top 0.356: BMB2P.5 82.55,118.11 v82.55,106.68 84.4,104.83 MM32K.72 | v55.88,104.14 54.61,102.87 48.26,102.87 41.6,96.21 MMU8L.56
  Bottom 0.356: v82.55,106.68 82.55,104.14 74.93,104.14 73.66,105.41 57.15,105.41 v55.88,104.14
MB10  (via drill 0.81)
  Top 0.356: BMB2P.3 80.01,118.11 v80.01,106.68 80.01,104.76 80.9,103.87 MM32K.76 | v53.34,106.68 52.07,105.41 48.26,105.41 40.6,97.75 MMU8L.58
  Bottom 0.356: v80.01,106.68 74.93,106.68 73.66,107.95 54.61,107.95 v53.34,106.68
MB11  (via drill 0.81)
  Top 0.356: BMB2P.1 77.47,118.11 v77.47,107.95 77.47,88.9 78.32,88.05 MM32K.77 | v52.07,107.95 50.8,106.68 48.26,106.68 39.6,98.02 MMU8L.60
  Bottom 0.356: v77.47,107.95 74.93,107.95 73.66,109.22 53.34,109.22 v52.07,107.95
MBODD_P  (via drill 0.81)
  Top 0.356: v86.36,45.72 86.36,46.99 85.72,47.62 85.72,66.04 86.9,67.22 MM32K.9
  Bottom 0.356: MEM2P.9 91.44,30.48 100.33,30.48 105.41,35.56 105.41,40.64 100.33,45.72 v86.36,45.72
MEM00
  Top 0.356: MEM1P.15 95.25,26.67 95.25,46.99 91.9,50.34 MM32K.19
MEM01
  Top 0.356: MEM1P.13 92.71,26.67 92.71,46.99 90.4,49.3 MM32K.16
MEM02
  Top 0.356: MEM1P.11 90.17,26.67 90.17,46.99 87.63,49.53 87.63,64.14 88.9,65.41 MM32K.13
MEM03
  Top 0.356: MEM1P.9 87.63,26.67 87.63,46.99 86.36,48.26 86.36,65.41 87.4,66.44 MM32K.10
MEM04
  Top 0.356: MEM1P.7 85.09,26.67 85.09,66.67 86.4,67.98 MM32K.8
MEM05
  Top 0.356: MEM1P.5 82.55,26.67 82.55,46.99 84.45,48.9 84.45,67.31 85.9,68.75 MM32K.7
MEM06
  Top 0.356: MEM1P.3 80.01,26.67 80.01,46.99 83.82,50.8 83.82,67.94 85.4,69.53 MM32K.6
MEM07
  Top 0.356: MEM1P.1 77.47,26.67 77.47,46.99 81.28,50.8 81.28,67.94 83.4,70.06 MM32K.2
MEM08  (via drill 0.81)
  Top 0.356: v96.52,40.64 96.52,46.99 92.4,51.11 MM32K.20
  Bottom 0.356: MEM2P.17 97.79,36.83 100.33,36.83 100.33,40.64 v96.52,40.64
MEM09  (via drill 0.81)
  Top 0.356: v93.98,41.91 93.98,46.99 91.84,49.26 90.9,50.2 MM32K.17
  Bottom 0.356: MEM2P.15 95.25,34.29 100.33,34.29 101.6,35.56 101.6,40.64 100.33,41.91 v93.98,41.91
MEM10  (via drill 0.81)
  Top 0.356: v91.44,43.18 91.44,46.99 88.27,50.16 88.27,63.5 89.4,64.64 MM32K.14
  Bottom 0.356: MEM2P.13 93.98,33.02 100.33,33.02 102.87,35.56 102.87,40.64 100.33,43.18 v91.44,43.18
MEM11  (via drill 0.81)
  Top 0.356: v88.9,44.45 88.9,46.99 87,48.9 87,64.77 88.4,66.17 MM32K.12
  Bottom 0.356: MEM2P.11 92.71,31.75 100.33,31.75 104.14,35.56 104.14,40.64 100.33,44.45 v88.9,44.45
MEM_P
  Top 0.356: MEM1P.17 97.79,26.67 97.79,46.99 92.9,51.88 MM32K.21
MEMSTART  (via drill 0.81)
  Top 0.356: BMA2P.7 135.89,36.83 135.89,41.27 135.41,41.76 R1.1 136.21,41.91 137.16,43.18 v137.16,46.99 | MMU8L.32 54.15,79.55 54.61,80.01 v57.15,80.01 57.61,79.55 MM32K.94
  Bottom 0.356: v137.16,46.99 137.16,48.26 134.62,50.8 67.31,50.8 57.15,60.96 v57.15,80.01
N$1
  Top 0.356: R4.1 17.78,33.02 16.51,31.75 12.7,31.75 11.93,32.52 J2.B5
N$2
  Bottom 0.356: E3.17 E3A.17
N$3
  Bottom 0.356: E3A.18 E3.18
N$4
  Bottom 0.356: E3A.19 E3.19
N$5
  Top 0.356: J2.A5 13.79,33.52 R3.1
PARITY
  Top 0.356: E3.16 161.29,74.93 121.92,74.93 117.8,79.05 MM32K.31
  Bottom 0.356: E3A.16 E3.16
POWER_OK  (via drill 0.81)
  Top 0.356: v27.94,40.64 27.94,41.91 34.1,48.07 MMU8L.5
  Bottom 0.356: CPU2P.3 26.67,34.29 24.13,34.29 22.86,35.56 22.86,40.64 24.13,41.91 26.67,41.91 v27.94,40.64
STOP_OK  (via drill 0.81)
  Top 0.356: v30.48,40.64 30.48,41.91 35.1,46.53 MMU8L.7
  Bottom 0.356: CPU2P.5 27.94,33.02 24.13,33.02 21.59,35.56 21.59,40.64 24.13,43.18 27.94,43.18 v30.48,40.64
TCK1  (via drill 0.81)
  Top 0.356: PROG1.1 12.7,71.12 12.7,96.52 v20.32,104.14 | v38.73,88.9 38.6,89.03 MMU8L.62
  Bottom 0.356: v20.32,104.14 25.4,99.06 31.75,99.06 38.1,92.71 38.1,89.53 v38.73,88.9
TCK2  (via drill 0.81)
  Top 0.356: v89.53,93.34 89.4,93.21 MM32K.62
  Bottom 0.356: PROG2.1 67.31,69.85 67.31,85.09 73.66,91.44 87.63,91.44 v89.53,93.34
TDI1  (via drill 0.81)
  Top 0.356: PROG1.9 16.51,59.69 v26.67,59.69 | v31.1,59.6 33.6,62.1 MMU8L.4
  Bottom 0.356: v26.67,59.69 v31.1,59.6
TDI2  (via drill 0.81)
  Top 0.356: v82.55,57.15 83.19,57.78 83.19,68.58 84.4,69.8 MM32K.4
  Bottom 0.356: PROG2.9 67.31,57.15 v82.55,57.15
TDO1  (via drill 0.7, 0.81)
  Top 0.356: PROG1.3 16.51,67.31 16.51,69.85 13.97,72.39 13.97,95.25 v20.32,101.6 | v32.23,96.52 33.1,95.65 MMU8L.73
  Bottom 0.356: v20.32,101.6 25.4,96.52 v32.23,96.52
TDO2  (via drill 0.81)
  Top 0.356: v83.19,92.71 83.9,92 MM32K.73
  Bottom 0.356: PROG2.3 64.77,67.31 64.77,69.85 66.04,71.12 66.04,85.09 73.66,92.71 v83.19,92.71
TMS1  (via drill 0.81)
  Top 0.356: PROG1.5 16.51,62.23 19.05,62.23 v27.94,71.12 | v38.1,76.2 38.73,76.2 39.1,75.83 MMU8L.15
  Bottom 0.356: v27.94,71.12 31.75,74.93 36.83,74.93 v38.1,76.2
TMS2  (via drill 0.6, 0.81)
  Top 0.356: v89.53,63.5 89.88,63.8 89.9,63.82 MM32K.15 | PROG2.5 67.31,62.23 v73.66,62.23
  Bottom 0.356: v73.66,62.23 74.93,63.5 v89.53,63.5
TP2  (via drill 0.81)
  Top 0.356: BMA2P.3 130.81,36.83 R2.1 130.49,41.91 129.54,41.91 128.27,43.18 v128.27,46.99 | MMU8L.30 53.53,78.55 v54.61,77.47 57.15,77.47 57.73,78.05 MM32K.97
  Bottom 0.356: v128.27,46.99 127,48.26 67.31,48.26 54.61,60.96 v54.61,77.47
TP3
  Top 0.356: CPU1P.11 39.37,26.67 39.37,41.91 37.6,43.68 MMU8L.12
TS1
  Top 0.356: R9.1 120.65,116.84 129.54,116.84 BAC2P.3
TS3
  Top 0.356: R8.1 116.84,115.57 130.81,115.57 BAC2P.5
VCC  (via drill 0.81)
  Top 0.356: E3A.28 C17.1 127.95,56.83 127,55.88 v106.68,38.1 | E4A.28 C18.1 | 5.7,34.29 5.7,31.75 5.95,31.5 J2.A9 9.14,31.5 13.97,26.67 | J2.B9 5.95,34.54 5.7,34.29 | 5.7,34.29 5.7,56.5 13.97,64.77 16.51,64.77 PROG1.4 26.67,74.93 30.48,74.93 31.75,76.2 v33.02,76.2 33.1,76.12 MMU8L.3 | 13.97,26.67 22.86,17.78 22.86,15.24 25.4,12.7 99.06,12.7 v106.68,20.32 | v40.64,76.2 40.6,76.16 MMU8L.18 | v43.18,78.74 44.99,80.55 MMU8L.34 | v43.81,87 44.1,87.28 MMU8L.51 | MMU8L.82 31.29,85.55 v31.75,85.09 33.02,86.36 34.29,86.36 v36.83,88.9 36.6,89.13 MMU8L.66 | v31.75,80.64 31.34,81.05 MMU8L.91 | v39.37,82.55 39.87,83.05 MMU8L.39 | v52.07,64.77 67.31,64.77 PROG2.4 77.47,74.93 81.28,74.93 82.55,76.2 v83.82,76.2 83.9,76.12 MM32K.3 | MM32K.82 82.09,85.55 v82.55,85.09 83.82,86.36 85.09,86.36 v87.63,88.9 87.4,89.13 MM32K.66 | v82.55,81.28 82.32,81.05 MM32K.91 | v94.61,87 94.9,87.28 MM32K.51 | v90.17,82.55 90.67,83.05 MM32K.39 | v94.61,79.38 95.79,80.55 MM32K.34 | v91.44,76.2 91.4,76.16 MM32K.18 | Q1.14 69.85,107.95 69.85,104.14 | 69.85,104.14 69.85,95.25 v74.93,90.17 | C19.1 20.32,33.02 13.97,26.67 | C20.1 69.85,104.14
  Bottom 0.356: E4.28 E4A.28 130.81,91.44 130.81,74.93 E3.28 E3A.28 | C3.1 33.02,79.06 34.29,80.01 39.37,80.01 | 39.37,80.01 40.32,79.06 | 40.32,79.06 C4.1 40.64,78.42 v40.64,76.2 | v106.68,20.32 v106.68,38.1 | C3.1 33.02,78.42 v33.02,76.2 | 40.32,79.06 40.64,78.74 v43.18,78.74 | v43.18,78.74 44.13,79.69 C5.1 C2.1 44.13,86.68 | v43.81,87 44.13,86.68 | C6.1 44.13,86.68 | v31.75,85.09 33.02,86.36 C8.1 C1.1 33.34,82.23 v31.75,80.64 33.34,79.06 C3.1 | v36.83,88.9 C7.1 | v39.37,82.55 39.37,80.01 | v52.07,64.77 43.18,73.66 v43.18,78.74 | v82.55,85.09 83.82,86.36 C16.1 C9.1 v82.55,81.28 82.55,80.33 C11.1 | v83.82,76.2 84.14,76.52 C11.1 | 90.17,80.01 85.09,80.01 84.14,79.06 C11.1 | 90.17,80.01 91.12,79.06 C12.1 | v87.63,88.9 C15.1 84.77,90.17 v74.93,90.17 | C14.1 94.93,87.31 v94.61,87 94.93,86.68 C10.1 C13.1 94.93,79.69 v94.61,79.38 93.98,78.74 C12.1 | v90.17,82.55 90.17,80.01 | v91.44,76.2 91.12,76.52 C12.1

## Text on the board
tPlace: Posibus Termination
tNames: 7 | 6 | 5 | 4 | 3 | 2 | 1 | 0